# EAGLE schematic MUC2022_CC (EAGLE 9.6.2)
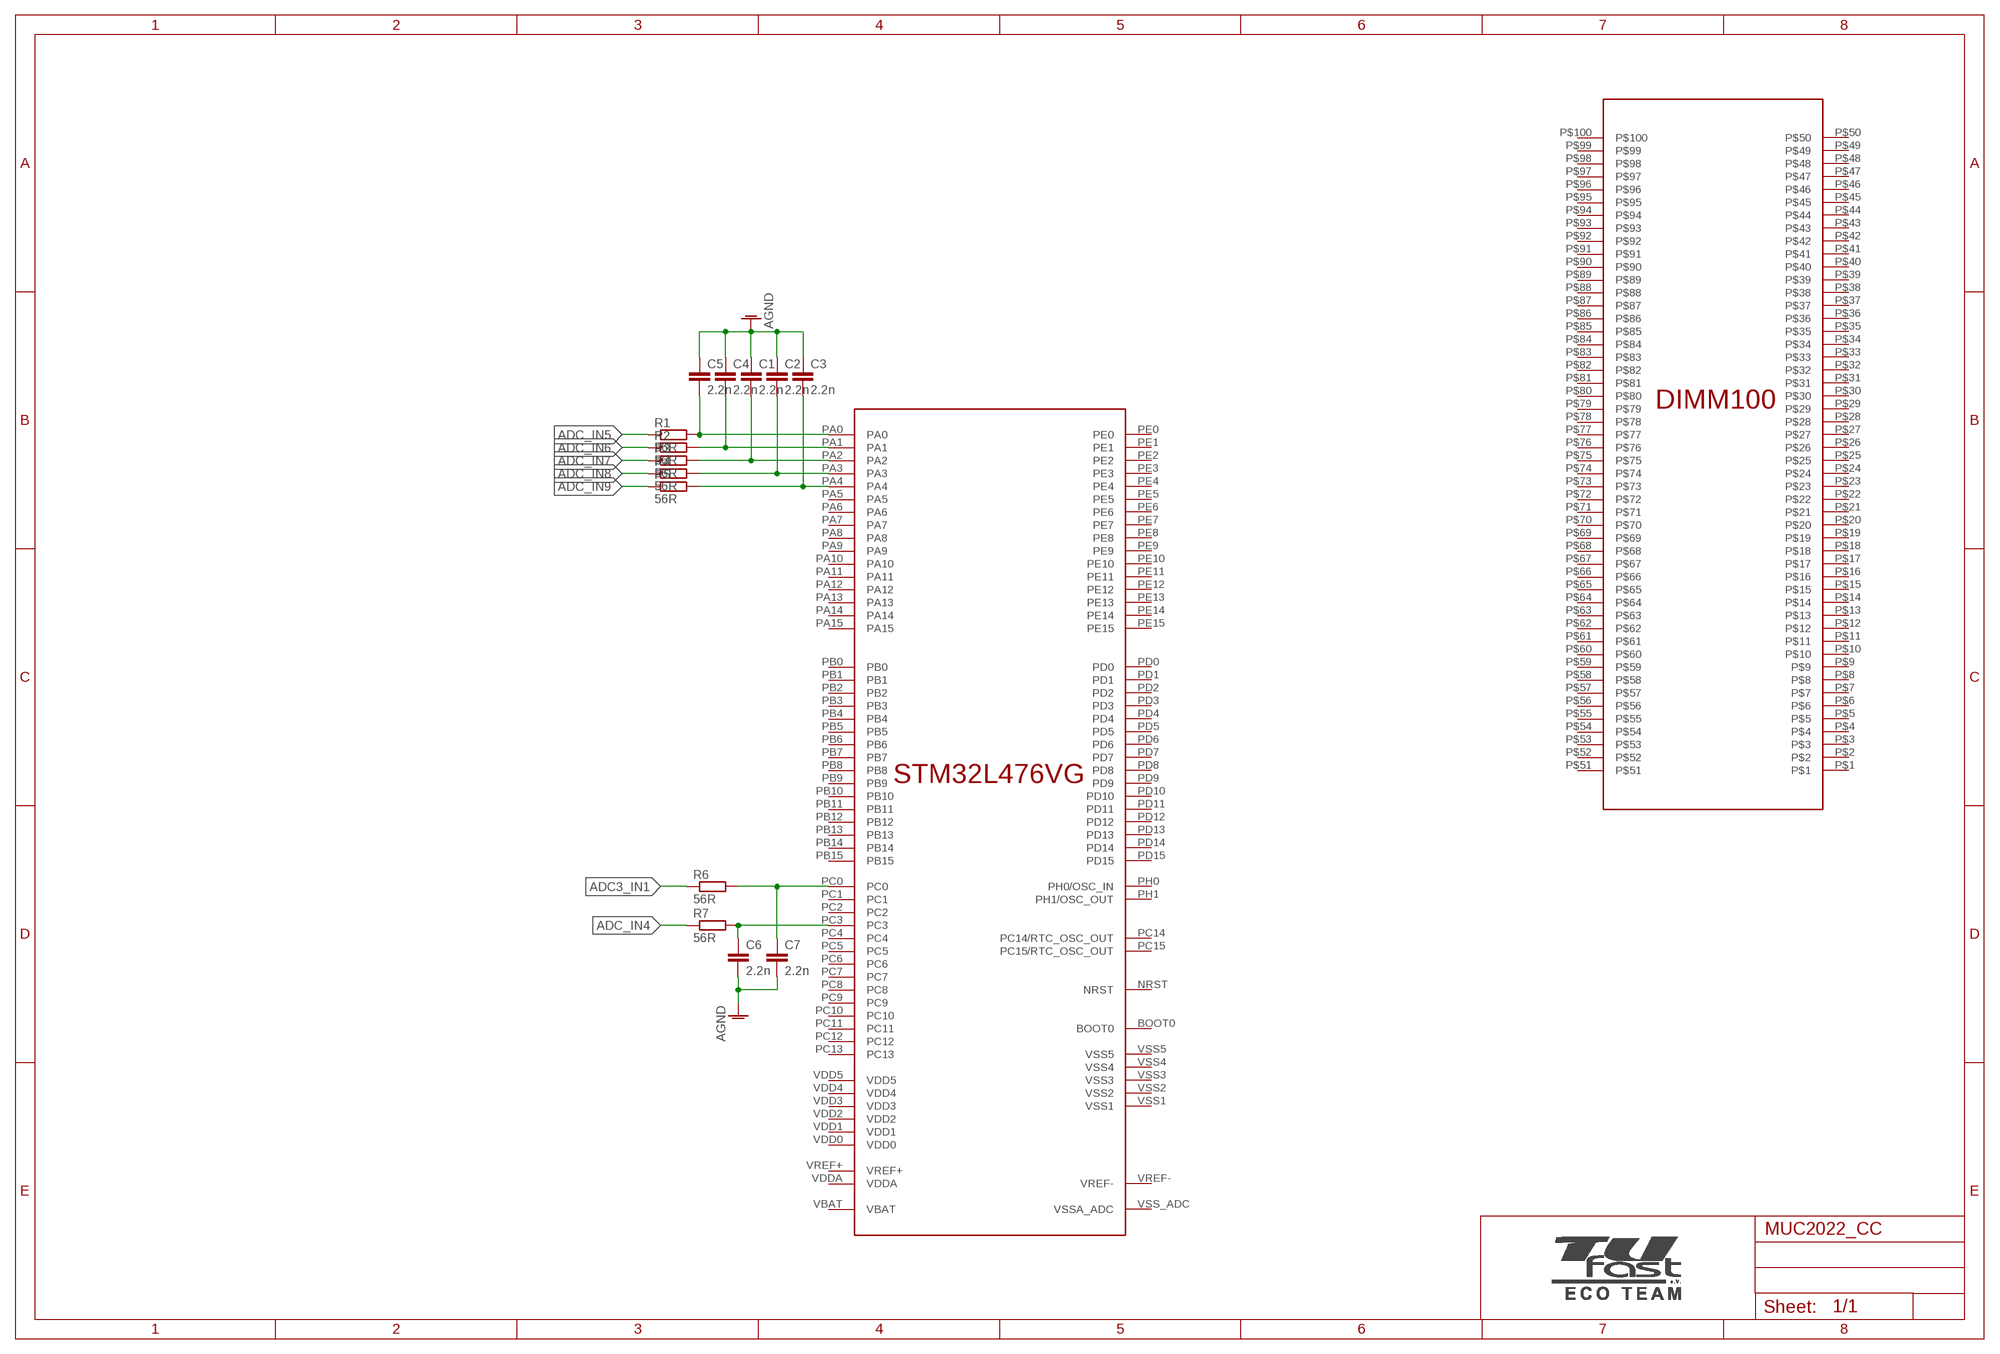
[diagram p0: schematic, sheet 1]

## Parts
C1  2.2n  C-EUC0402  [C0402]
C2  2.2n  C-EUC0402  [C0402]
C3  2.2n  C-EUC0402  [C0402]
C4  2.2n  C-EUC0402  [C0402]
C5  2.2n  C-EUC0402  [C0402]
C6  2.2n  C-EUC0402  [C0402]
C7  2.2n  C-EUC0402  [C0402]
R1  56R  R-EU_R0402  [R0402]
R2  56R  R-EU_R0402  [R0402]
R3  56R  R-EU_R0402  [R0402]
R4  56R  R-EU_R0402  [R0402]
R5  56R  R-EU_R0402  [R0402]
R6  56R  R-EU_R0402  [R0402]
R7  56R  R-EU_R0402  [R0402]
U$2  STM32L476VG  [STM32L476VG]
U$3  DIMM100  [DIMM100]

## Nets
ADC3_IN1: R6.1
ADC_IN4: R7.1
ADC_IN5: R1.1
ADC_IN6: R2.1
ADC_IN7: R3.1
ADC_IN8: R4.1
ADC_IN9: R5.1
AGND: C1.1 C2.1 C3.1 C4.1 C5.1 C6.2 C7.2
N$1: C5.2 R1.2 U$2.PA0
N$2: C4.2 R2.2 U$2.PA1
N$3: C1.2 R3.2 U$2.PA2
N$4: C2.2 R4.2 U$2.PA3
N$5: C3.2 R5.2 U$2.PA4
N$6: C6.1 R7.2 U$2.PC3
N$7: C7.1 R6.2 U$2.PC0
Unconnected: U$2.BOOT0 U$2.NRST U$2.PA5 U$2.PA6 U$2.PA7 U$2.PA8 U$2.PA9 U$2.PA10 U$2.PA11 U$2.PA12 U$2.PA13 U$2.PA14 U$2.PA15 U$2.PB0 U$2.PB1 U$2.PB2 U$2.PB3 U$2.PB4 U$2.PB5 U$2.PB6 U$2.PB7 U$2.PB8 U$2.PB9 U$2.PB10 U$2.PB11 U$2.PB12 U$2.PB13 U$2.PB14 U$2.PB15 U$2.PC1 U$2.PC2 U$2.PC4 U$2.PC5 U$2.PC6 U$2.PC7 U$2.PC8 U$2.PC9 U$2.PC10 U$2.PC11 U$2.PC12 U$2.PC13 U$2.PC14(PC14/RTC_OSC_OUT) U$2.PC15(PC15/RTC_OSC_OUT) U$2.PD0 U$2.PD1 U$2.PD2 U$2.PD3 U$2.PD4 U$2.PD5 U$2.PD6 U$2.PD7 U$2.PD8 U$2.PD9 U$2.PD10 U$2.PD11 U$2.PD12 U$2.PD13 U$2.PD14 U$2.PD15 U$2.PE0 U$2.PE1 U$2.PE2 U$2.PE3 U$2.PE4 U$2.PE5 U$2.PE6 U$2.PE7 U$2.PE8 U$2.PE9 U$2.PE10 U$2.PE11 U$2.PE12 U$2.PE13 U$2.PE14 U$2.PE15 U$2.PH0(PH0/OSC_IN) U$2.PH1(PH1/OSC_OUT) U$2.VBAT U$2.VDD0 U$2.VDD1 U$2.VDD2 U$2.VDD3 U$2.VDD4 U$2.VDD5 U$2.VDDA U$2.VREF+ U$2.VREF- U$2.VSS1 U$2.VSS2 U$2.VSS3 U$2.VSS4 U$2.VSS5 U$2.VSS_ADC(VSSA_ADC) U$3.P$1 U$3.P$2 U$3.P$3 U$3.P$4 U$3.P$5 U$3.P$6 U$3.P$7 U$3.P$8 U$3.P$9 U$3.P$10 U$3.P$11 U$3.P$12 U$3.P$13 U$3.P$14 U$3.P$15 U$3.P$16 U$3.P$17 U$3.P$18 U$3.P$19 U$3.P$20 U$3.P$21 U$3.P$22 U$3.P$23 U$3.P$24 U$3.P$25 U$3.P$26 U$3.P$27 U$3.P$28 U$3.P$29 U$3.P$30 U$3.P$31 U$3.P$32 U$3.P$33 U$3.P$34 U$3.P$35 U$3.P$36 U$3.P$37 U$3.P$38 U$3.P$39 U$3.P$40 U$3.P$41 U$3.P$42 U$3.P$43 U$3.P$44 U$3.P$45 U$3.P$46 U$3.P$47 U$3.P$48 U$3.P$49 U$3.P$50 U$3.P$51 U$3.P$52 U$3.P$53 U$3.P$54 U$3.P$55 U$3.P$56 U$3.P$57 U$3.P$58 U$3.P$59 U$3.P$60 U$3.P$61 U$3.P$62 U$3.P$63 U$3.P$64 U$3.P$65 U$3.P$66 U$3.P$67 U$3.P$68 U$3.P$69 U$3.P$70 U$3.P$71 U$3.P$72 U$3.P$73 U$3.P$74 U$3.P$75 U$3.P$76 U$3.P$77 U$3.P$78 U$3.P$79 U$3.P$80 U$3.P$81 U$3.P$82 U$3.P$83 U$3.P$84 U$3.P$85 U$3.P$86 U$3.P$87 U$3.P$88 U$3.P$89 U$3.P$90 U$3.P$91 U$3.P$92 U$3.P$93 U$3.P$94 U$3.P$95 U$3.P$96 U$3.P$97 U$3.P$98 U$3.P$99 U$3.P$100

## Library data of the parts
C1-C7 = rcl:C-EU: CAPACITOR, European symbol; SPICEPREFIX: C
R1-R7 = rcl:R-EU_: RESISTOR, European symbol; SPICEPREFIX: R
U$2 = STM32L476VG:STM32L476VG
U$3 = DIMM100:DIMM100